# EAGLE design smart prototyping2 (EAGLE 7.3.0)
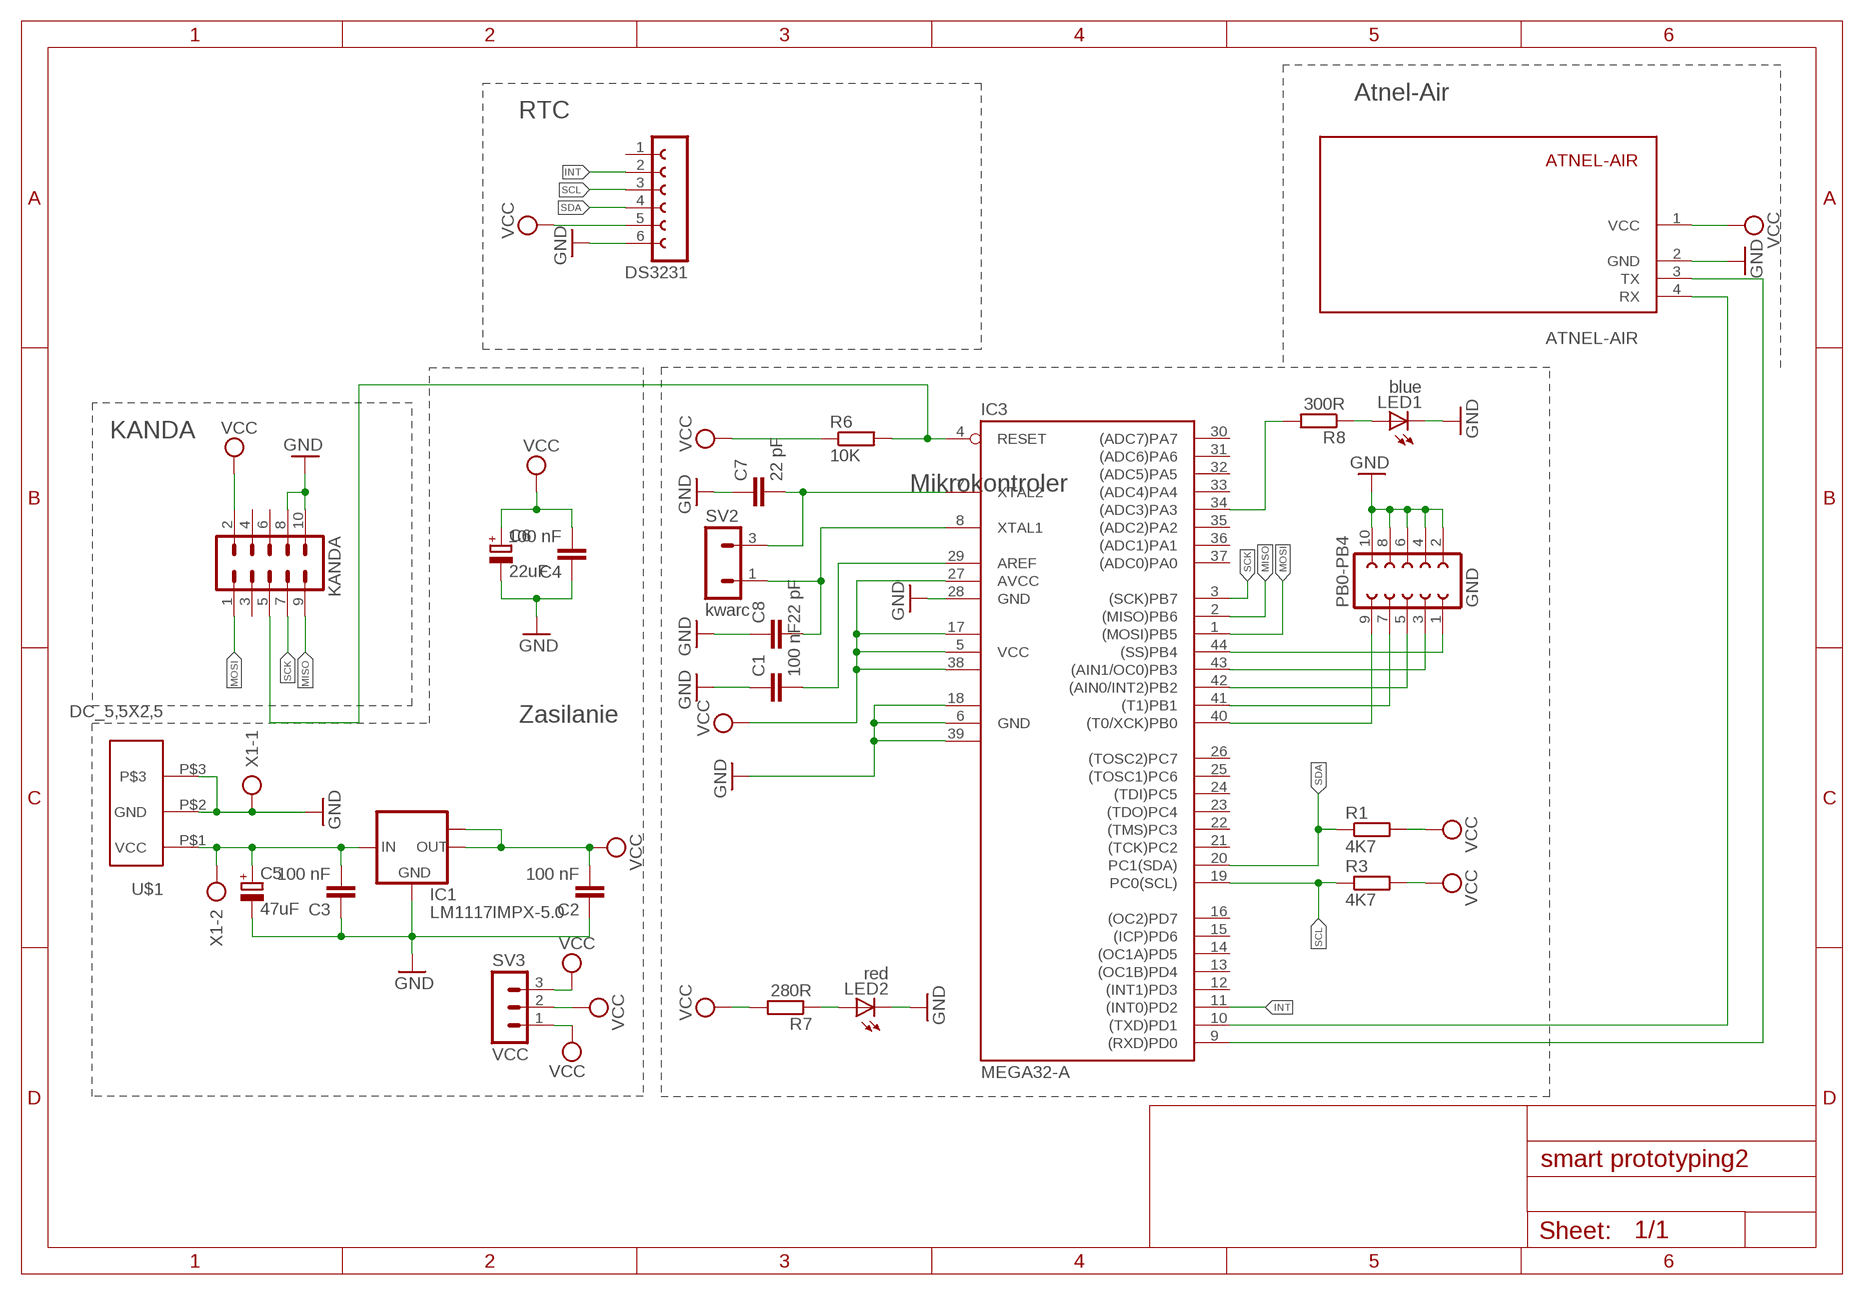
[diagram p0: schematic, sheet 1]

## Parts
ATNEL-AIR  ATNEL-AIR  [ATNEL-AIR]
C1  100 nF  C-EUC0805  [C0805]
C2  100 nF  C-EUC0805  [C0805]
C3  100 nF  C-EUC0805  [C0805]
C4  100 nF  C-EUC0805  [C0805]
C5  47uF  CPOL-EUB45181A  [B45181A]
C6  22uF  CPOL-EUB45181A  [B45181A]
C7  22 pF  C-EUC0805  [C0805]
C8  22 pF  C-EUC0805  [C0805]
DS3231  FE06-1  [FE06]
IC1  LM1117IMPX-5.0  [SOT223]
IC3  MEGA32-A  [TQFP44]
KANDA  ML10  [ML10]
LED1  blue  LEDCHIPLED_1206  [CHIPLED_1206]
LED2  red  LEDCHIPLED_1206  [CHIPLED_1206]
PB0-PB4  GND  FE05-2  [FE05-2]
R1  4K7  R-EU_R1206W  [R1206W]
R3  4K7  R-EU_R1206W  [R1206W]
R6  10K  R-EU_R1206W  [R1206W]
R7  280R  R-EU_R1206W  [R1206W]
R8  300R  R-EU_R1206W  [R1206W]
SV2  kwarc  MA03-1  [MA03-1]
SV3  VCC  MA03-1  [MA03-1]
U$1  DC_5,5X2,5  [DC_5,5X2,5]
X1  AK500/2  [AK500/2]

## Nets
GND: ATNEL-AIR.2(GND) C1.1 C2.1 C3.1 C4.1 C5.- C6.- C7.1 C8.1 DS3231.6 IC1.1(GND) IC3.6(GND) IC3.18(GND1) IC3.28(GND) IC3.39(GND2) KANDA.8 KANDA.10 LED1.C LED2.C PB0-PB4.2 PB0-PB4.4 PB0-PB4.6 PB0-PB4.8 PB0-PB4.10 U$1.P$2(GND) U$1.P$3 X1.1
INT: DS3231.2 IC3.11((INT0)PD2)
MISO: IC3.2((MISO)PB6) KANDA.9
MOSI: IC3.1((MOSI)PB5) KANDA.1
N$1: ATNEL-AIR.4(RX) IC3.10((TXD)PD1)
N$2: ATNEL-AIR.3(TX) IC3.9((RXD)PD0)
N$3: C1.2 IC3.29(AREF)
N$4: IC3.44((SS)PB4) PB0-PB4.1
N$5: IC3.43((AIN1/OC0)PB3) PB0-PB4.3
N$6: C3.2 C5.+ IC1.3(IN) U$1.P$1(VCC) X1.2
N$7: IC3.42((AIN0/INT2)PB2) PB0-PB4.5
N$8: IC3.41((T1)PB1) PB0-PB4.7
N$9: IC3.40((T0/XCK)PB0) PB0-PB4.9
N$10: C7.2 IC3.7(XTAL2) SV2.3
N$11: C8.2 IC3.8(XTAL1) SV2.1
N$12: LED2.A R7.1
N$16: LED1.A R8.1
N$17: IC3.34((ADC3)PA3) R8.2
RST: IC3.4(RESET) KANDA.5 R6.2
SCK: IC3.3((SCK)PB7) KANDA.7
SCL: DS3231.3 IC3.19(PC0(SCL)) R3.1
SDA: DS3231.4 IC3.20(PC1(SDA)) R1.1
VCC: ATNEL-AIR.1(VCC) C2.2 C4.2 C6.+ DS3231.5 IC1.2(OUT) IC1.TAB(OUT1) IC3.5(VCC) IC3.17(VCC1) IC3.27(AVCC) IC3.38(VCC2) KANDA.2 R1.2 R3.2 R6.1 R7.2 SV3.1 SV3.2 SV3.3
Unconnected: DS3231.1 IC3.12((INT1)PD3) IC3.13((OC1B)PD4) IC3.14((OC1A)PD5) IC3.15((ICP)PD6) IC3.16((OC2)PD7) IC3.21((TCK)PC2) IC3.22((TMS)PC3) IC3.23((TDO)PC4) IC3.24((TDI)PC5) IC3.25((TOSC1)PC6) IC3.26((TOSC2)PC7) IC3.30((ADC7)PA7) IC3.31((ADC6)PA6) IC3.32((ADC5)PA5) IC3.33((ADC4)PA4) IC3.35((ADC2)PA2) IC3.36((ADC1)PA1) IC3.37((ADC0)PA0) KANDA.3 KANDA.4 KANDA.6

## Notes on the sheet
- Atnel-Air
- RTC
- KANDA
- Mikrokontroler
- Zasilanie

## Library data of the parts
ATNEL-AIR = ATNEL-WIFI232-T:ATNEL-AIR
C1-C4 C7 C8 = rcl:C-EU: CAPACITOR, European symbol
C5 C6 = rcl:CPOL-EU: POLARIZED CAPACITOR, European symbol
DS3231 = con-lsta:FE06-1: FEMALE HEADER; OC_FARNELL: unknown; OC_NEWARK: unknown
IC1 = lm1117:LM1117IMPX-*
IC3 = atmel:MEGA32: MICROCONTROLLER 32 Kbytes FLASH 2 Kbytes SRAM 1 Kbytes EEPROM USART 8-channel 10 bit ADC Source: www.atmel.com .. doc2503.pdf; MPN: ATMEGA32-16AU; OC_FARNELL: 9171274; OC_NEWARK: 69K6677
KANDA = con-harting-ml:ML10: HARTING; OC_FARNELL: unknown; OC_NEWARK: unknown
LED1 LED2 = adafruit:LED: LED OSRAM: - CHIPLED LG R971, LG N971, LY N971, LG Q971, LY Q971, LO R971, LY R971 LH N974, LH R974 LS Q976, LO Q976, LY Q976 LO Q996 - Hyper CHIPLED LW Q18S LB Q993, LB Q99A, LB R99A - SideLED LS A670, LO A670, LY A670, LG A670, LP A670 LB A673, LV A673, LT A673, LW A673 LH A674 LY A675 LS A676, LA A676, LO A676, LY A676, LW A676 LS A679, LY A679, LG A679 - Hyper Micro SIDELED® LS Y876, LA Y876, LO Y876, LY Y876 LT Y87S - SmartLED LW L88C, LW L88S LB L89C, LB L89S, LG L890 LS L89K, LO L89K, LY L89K LS L896, LA L896, LO L896, LY L896 - TOPLED LS T670, LO T670, LY T670, LG T670, LP T670 LSG T670, LSP T670, LSY T670, LOP T670, LYG T670 LG T671, LOG T671, LSG T671 LB T673, LV T673, LT T673, LW T673 LH T674 LS T676, LA T676, LO T676, LY T676, LB T676, LH T676, LSB T676, LW T676 LB T67C, LV T67C, LT T67C, LS T67K, LO T67K, LY T67K, LW E67C LS E67B, LA E67B, LO E67B, LY E67B, LB E67C, LV E67C, LT E67C LW T67C LS T679, LY T679, LG T679 LS T770, LO T770, LY T770, LG T770, LP T770 LB T773, LV T773, LT T773, LW T773 LH T774 LS E675, LA E675, LY E675, LS T675 LS T776, LA T776, LO T776, LY T776, LB T776 LHGB T686 LT T68C, LB T68C - Hyper Mini TOPLED® LB M676 - Mini TOPLED Santana® LG M470 LS M47K, LO M47K, LY M47K Source: http://www.osram.convergy.de/
PB0-PB4 = con-lsta:FE05-2: FEMALE HEADER; OC_FARNELL: unknown; OC_NEWARK: unknown
R1 R3 R6-R8 = resistor:R-EU_: RESISTOR, European symbol
SV2 = con-lstb-wachcio:MA03-1: PIN HEADER; OC_FARNELL: unknown; OC_NEWARK: unknown
SV3 = con-lstb:MA03-1: PIN HEADER; OC_FARNELL: unknown; OC_NEWARK: unknown
U$1 = wachcio:DC_5,5X2,5
X1 = con-ptr500:AK500/2: CONNECTOR; OC_FARNELL: unknown; OC_NEWARK: unknown

## Board
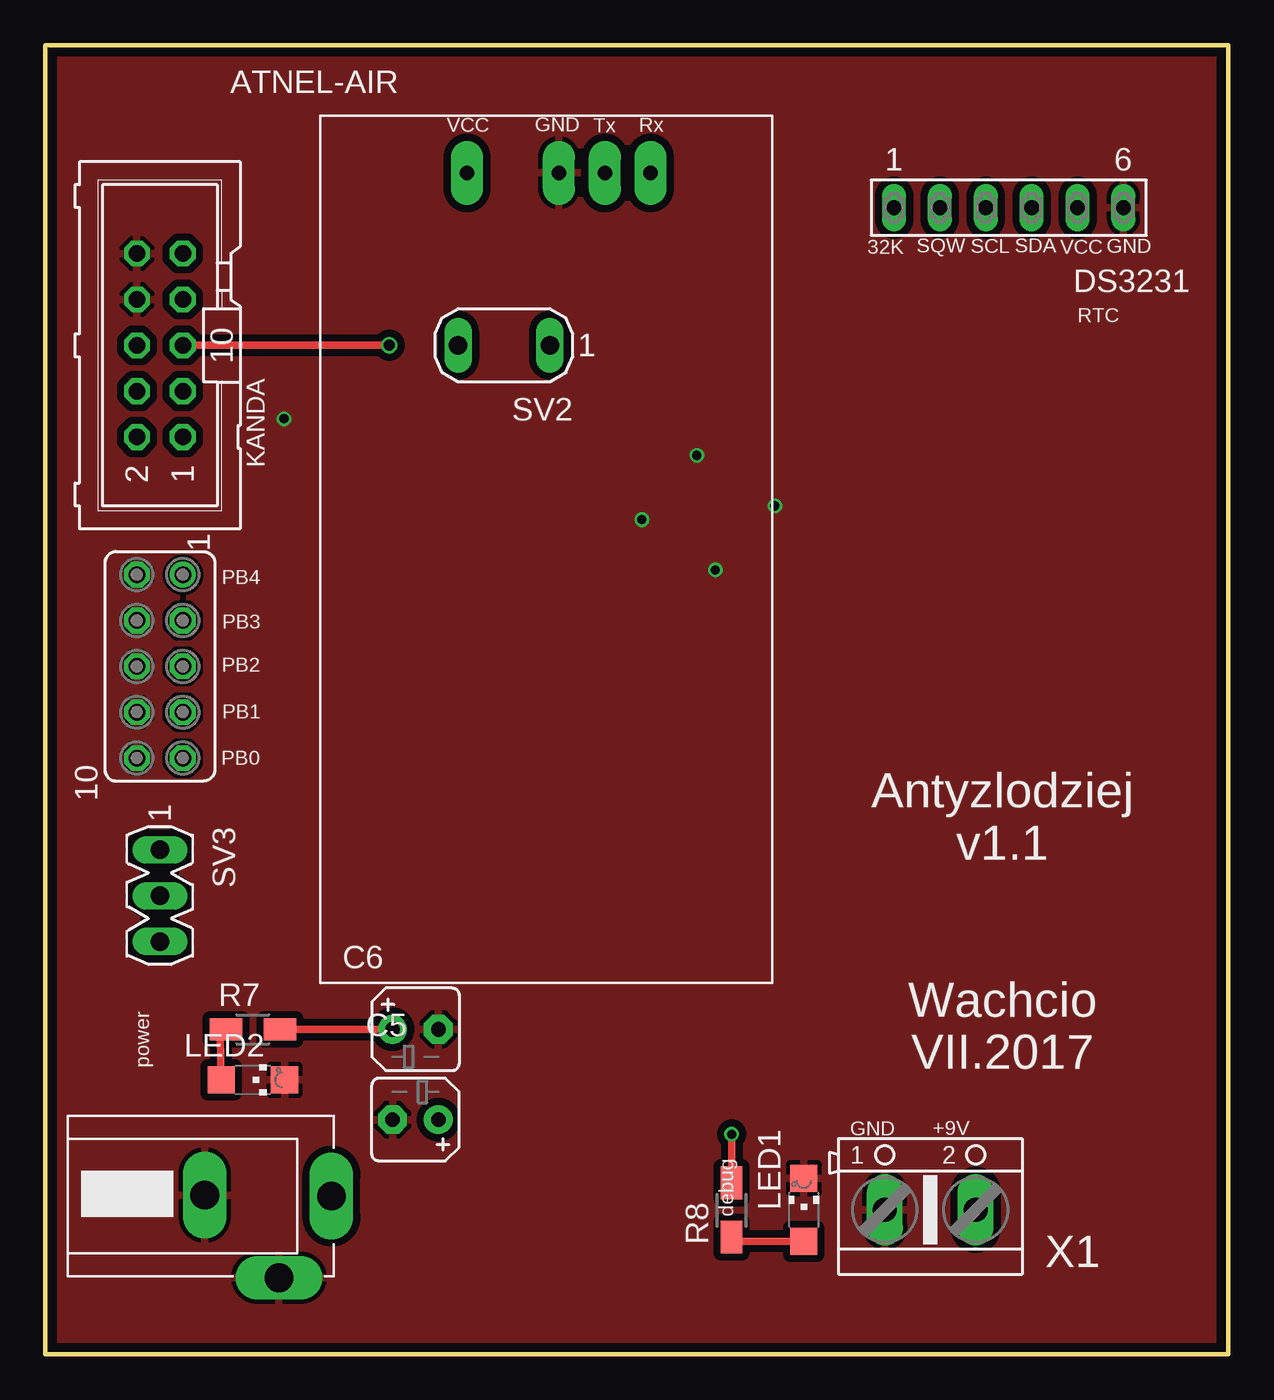
[diagram p1: board, top side]
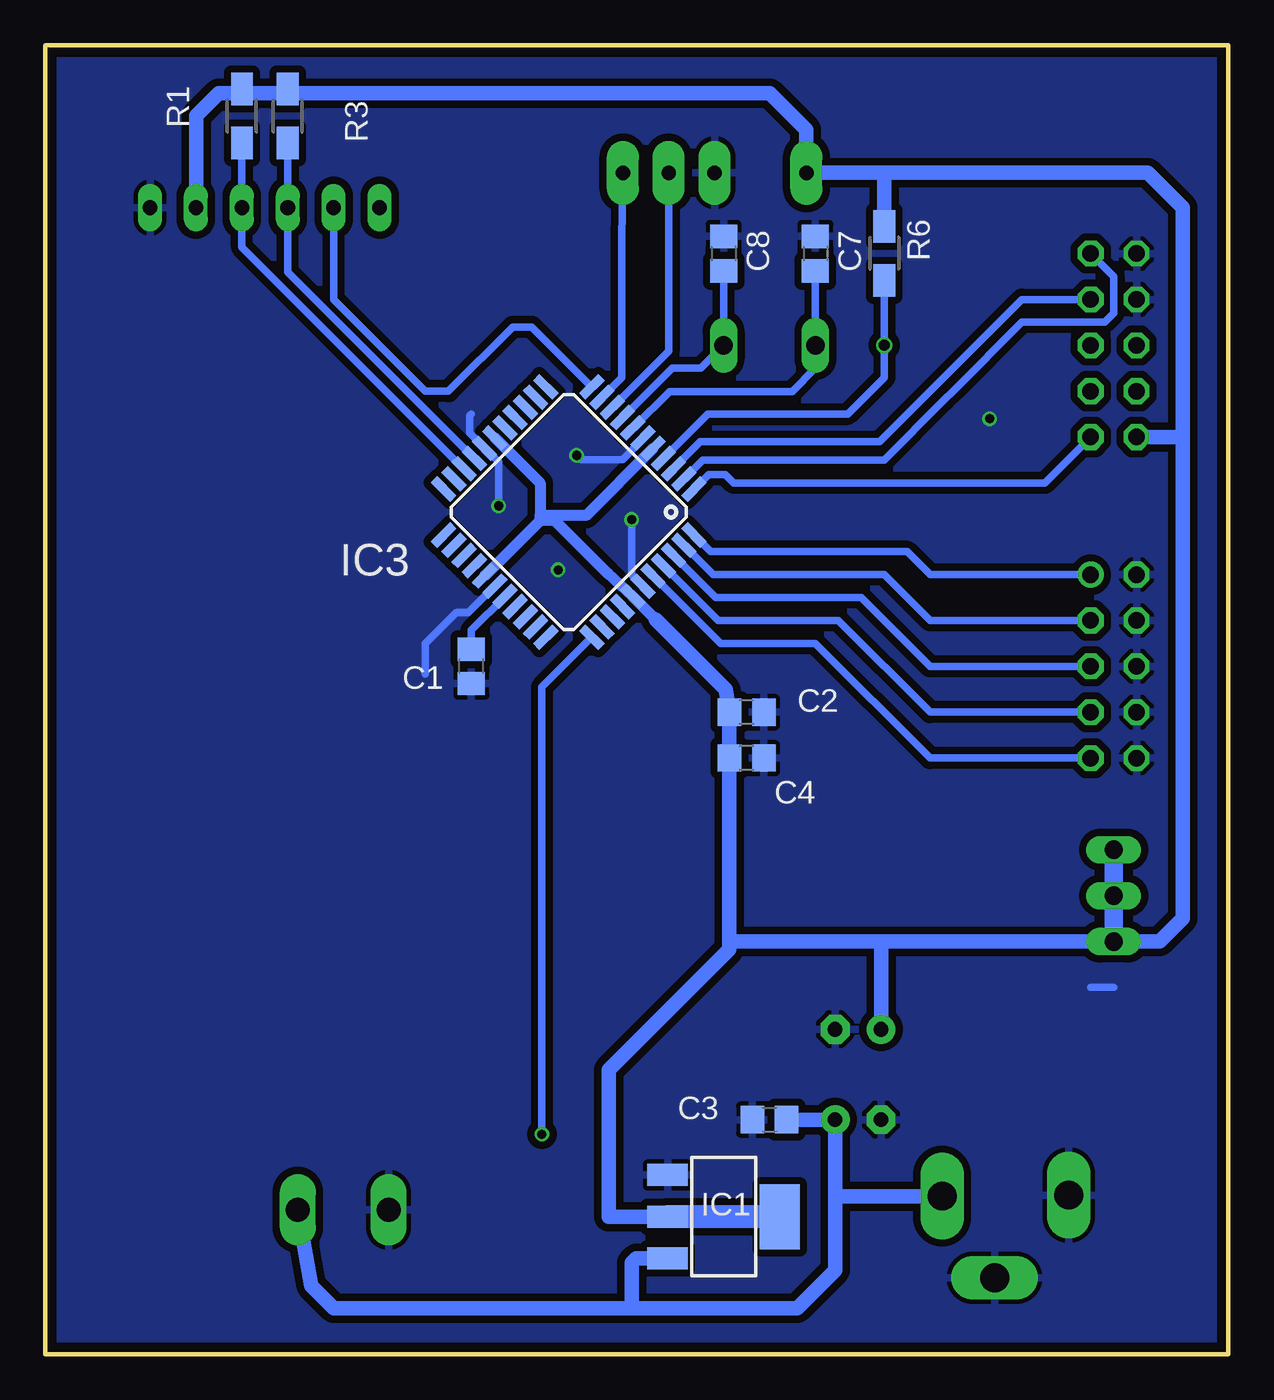
[diagram p2: board, bottom side, seen from below]

Size 65.5 x 72.5 mm. Coordinates in mm from the lower left corner, seen from the top.
Outline: 62.23,0 65.5,0
Outline: 65.5,0 0,0 0,72.5 65.5,72.5 65.5,0
Copper layers (1*16): Top 0.035mm / dielectric 1.5mm / Bottom 0.035mm
Design rules "smart-prototyping": minimum track width 7mil, minimum drill 12mil, track to track 7mil, track to pad 7mil, pad to pad 7mil, via to via 7mil, smd to smd 0mil, copper to edge 20mil, drill to drill 10mil, minimum pad ring 10mil, minimum via ring 6mil, stop-mask expansion 2mil, vias tented up to drill 25mil, thermal gap 10mil

### Footprints (pad centres in the part's own frame; a part is rotated, then mirrored left to right if it is on the bottom)
ATNEL-AIR = drill 0.8 pad 1.778 long: 1 3.15,8.12; 2 3.15,13.2; 3 3.15,15.74; 4 3.15,18.28
C0805 = smd 1.3 x 1.5: 1 -0.95,0; 2 0.95,0
B45181A = drill 0.813 pad 1.6: + -1.27,0 | drill 0.813 pad 1.6 octagon: - 1.27,0
FE06 = drill 0.813 long: 1 -6.35,0; 2 -3.81,0; 3 -1.27,0; 4 1.27,0; 5 3.81,0; 6 6.35,0
SOT223 = smd 1.219 x 2.235: 1 -2.311,-3.099; 2 0,-3.099; 3 2.311,-3.099 | smd 3.6 x 2.2: TAB 0,3.099
TQFP44 = smd 1.5 x 0.5: 1 -5.8,4; 2 -5.8,3.2; 3 -5.8,2.4; 4 -5.8,1.6; 5 -5.8,0.8; 6 -5.8,0; 7 -5.8,-0.8; 8 -5.8,-1.6; 9 -5.8,-2.4; 10 -5.8,-3.2; 11 -5.8,-4; 23 5.8,-4; 24 5.8,-3.2; 25 5.8,-2.4; 26 5.8,-1.6; 27 5.8,-0.8; 28 5.8,0; 29 5.8,0.8; 30 5.8,1.6; 31 5.8,2.4; 32 5.8,3.2; 33 5.8,4 | smd 0.5 x 1.5: 12 -4,-5.8; 13 -3.2,-5.8; 14 -2.4,-5.8; 15 -1.6,-5.8; 16 -0.8,-5.8; 17 0,-5.8; 18 0.8,-5.8; 19 1.6,-5.8; 20 2.4,-5.8; 21 3.2,-5.8; 22 4,-5.8; 34 4,5.8; 35 3.2,5.8; 36 2.4,5.8; 37 1.6,5.8; 38 0.8,5.8; 39 0,5.8; 40 -0.8,5.8; 41 -1.6,5.8; 42 -2.4,5.8; 43 -3.2,5.8; 44 -4,5.8
ML10 = drill 0.914 octagon: 1 -5.08,-1.27; 2 -5.08,1.27; 3 -2.54,-1.27; 4 -2.54,1.27; 5 0,-1.27; 6 0,1.27; 7 2.54,-1.27; 8 2.54,1.27; 9 5.08,-1.27; 10 5.08,1.27
CHIPLED_1206 = smd 1.5 x 1.5: A 0,-1.75; C 0,1.75
FE05-2 = drill 0.914: 1 -5.08,1.27 | drill 0.914 octagon: 2 -5.08,-1.27; 3 -2.54,1.27; 4 -2.54,-1.27; 5 0,1.27; 6 0,-1.27; 7 2.54,1.27; 8 2.54,-1.27; 9 5.08,1.27; 10 5.08,-1.27
R1206W = smd 1.8 x 1.2: 1 -1.499,0; 2 1.499,0
MA03-1 = drill 1.016 long: 1 -2.54,0; 3 2.54,0
MA03-1' = drill 1.016 long: 1 -2.54,0; 2 0,0; 3 2.54,0
DC_5,5X2,5 = drill 1.6 long: P$1 14.605,4.445; P$2 11.7,-0.07; P$3 7.6,4.5
AK500/2 = drill 1.321 long: 1 -2.515,0; 2 2.515,0

### Placement (x,y rotation side)
ATNEL-AIR  15.24,68.58 270 top
C1  41.91,38.1 90 bottom
C2  26.67,35.56 180 bottom
C3  25.4,13 0 bottom
C4  26.67,33.02 180 bottom
C5  20.5,13 180 top
C6  20.5,18 0 top
C7  22.86,60.96 270 bottom
C8  27.94,60.96 270 bottom
DS3231  53.34,63.5 0 top
IC1  27.94,7.62 270 bottom
IC3  36.51,46.64 225 bottom
KANDA  6.35,55.88 90 top
LED1  42,8 0 top
LED2  11.5,15.2 270 top
PB0-PB4  6.35,38.1 270 top
R1  54.61,68.58 90 bottom
R3  52.07,68.58 90 bottom
R6  19.05,60.96 270 bottom
R7  11.5,18 0 top
R8  38,8 90 top
SV2  25.4,55.88 180 top
SV3  VCC  [MA03-1']  6.35,25.4 270 top
U$1  1.24,4.32 0 top
X1  49,8 0 top

### Tracks (layer width: path | path; a pad name or v marks a point on that pad's centre or on a via)
GND  (via drill 0.5)
  Bottom 0.406: 41.91,52.07 41.99,51.99 41.99,51 41.18,50.19 IC3.18 40.4,49.4 v40.4,46.99 | 41.18,50.17 41.15,50.17 | IC3.28 42.09,41.07 42.75,41.07 44.45,39.37 44.45,37.67 | 6.35,20.32 7.62,20.32 | IC3.6 32.41,50.68 33.53,49.55 35.85,49.55 v36.08,49.78 | v33.03,46.23 33.03,43.17 IC3.39
  Bottom 0.5: IC3.18 41.18,50.17 | IC3.6
  other vias: 37.1,43.43 13.22,51.82
  pour Bottom (isolate 0.406, rank 4): 0,0 0,72.5 65.5,72.5 65.5,0
  pour Top (isolate 0.406): 0,0 0,72.5 65.5,72.5 65.5,0
INT
  Bottom 0.406: IC3.11 38.56,56.9 39.62,56.9 43.18,53.34 44.45,53.34 49.53,58.42 DS3231.2
MISO
  Bottom 0.406: IC3.2 29.1,49.53 19.05,49.53 15.75,52.83 15.24,53.34 11.43,57.15 6.86,57.15 6.35,57.66 6.35,59.69 KANDA.9
MOSI
  Bottom 0.406: 29.55,47.92 IC3.1 28.78,48.72 27.84,48.72 27.38,48.26 10.16,48.26 KANDA.1
N$1
  Bottom 0.406: IC3.10 34.65,53.01 33.58,54.08 33.58,61.56 ATNEL-AIR.4
N$2
  Bottom 0.406: ATNEL-AIR.3 30.98,55.57 IC3.9
N$3
  Bottom 0.406: IC3.29 41.91,40.11 C1.2
N$4
  Bottom 0.406: PB0-PB4.1 16.51,43.18 17.78,44.45 28.66,44.45 IC3.44
N$5
  Bottom 0.406: PB0-PB4.3 16.51,40.64 19.05,43.18 28.52,43.18 IC3.43
N$6
  Bottom 0.813: C3.2 C5.+ 21.77,8.76 | X1.2 50.77,3.79 49.53,2.54 33.02,2.54 | 33.02,2.54 23.88,2.54 21.77,4.65 21.77,8.76 | IC1.3 32.79,5.31 33.02,5.08 33.02,2.54 | U$1.P$1 21.77,8.76
N$7
  Bottom 0.406: PB0-PB4.5 16.51,38.1 20.32,41.91 28.38,41.91 IC3.42
N$8
  Bottom 0.406: PB0-PB4.7 16.51,35.56 21.59,40.64 28.24,40.64 IC3.41
N$9
  Bottom 0.406: PB0-PB4.9 16.51,33.02 22.86,39.37 28.1,39.37 IC3.40
N$10
  Bottom 0.406: IC3.7 32.94,51.31 30.94,53.31 24.16,53.31 22.86,54.61 SV2.3 C7.2
N$11
  Bottom 0.406: IC3.8 33.52,51.88 30.79,54.61 29.21,54.61 SV2.1 C8.2
N$12
  Top 0.406: R7.1 9.68,17.55 LED2.A
N$16
  Top 0.406: LED1.A 38,6.25 R8.1
N$17  (via drill 0.5)
  Top 0.406: v38,12.19 R8.2
  Bottom 0.406: v38,12.19 38,36.95 IC3.34
RST  (via drill 0.6)
  Top 0.406: KANDA.5 v19.05,55.88
  Bottom 0.406: IC3.4 28.82,52.07 21.08,52.07 19.05,54.1 v19.05,55.88 R6.2
SCK
  Bottom 0.406: IC3.3 30.71,49.07 29.23,50.55 19.3,50.55 11.43,58.42 KANDA.7
SCL
  Bottom 0.406: R3.1 DS3231.3 52.07,59.94 IC3.19
SDA
  Bottom 0.406: R1.1 DS3231.4 54.61,61.32 42.34,49.05 IC3.20
VCC
  Top 0.406: R7.2 C6.+
  Bottom 0.406: 40.59,50.74 IC3.17 40.61,50.77 | IC3.27 41.18,43.13
  Bottom 0.61: 31.69,40.7 IC3.38 34.36,43.25 37.29,46.18 38.1,46.18 | IC3.5 35.56,46.46 38.1,46.46 | 40.59,50.74 38.1,48.26 38.1,46.46 | 38.1,46.18 IC3.27 | 38.1,46.18 38.1,46.46
  Bottom 0.813: 2.54,50.8 2.54,24.13 3.81,22.86 SV3.3 19.23,22.86 | 2.54,50.8 2.54,63.5 4.47,65.43 19.05,65.43 | 54.38,69.85 R1.2 | 54.38,69.85 55.88,69.85 57.15,68.58 DS3231.5 | KANDA.2 2.54,50.8 | 54.38,69.85 52.3,69.85 R3.2 51.84,69.85 25.4,69.85 23.36,67.81 ATNEL-AIR.1 19.05,65.43 | R6.1 19.05,65.43 | IC1.2 34.29,7.62 34.29,15.75 27.62,22.42 27.62,22.86 | 31.69,40.7 27.83,36.83 C2.2 C4.2 27.62,24.13 27.62,22.86 | 19.23,22.86 C6.+ | 19.23,22.86 27.62,22.86
  Bottom 1.016: SV3.3 SV3.2 SV3.1
  Bottom 1.27: IC1.TAB IC1.2

### Text on the board
tPlace: VCC | GND | Tx | Rx | RTC | power | GND | +9V | debug
tNames: 32K | SQW | SCL | SDA | VCC | GND | PB4 | PB3 | PB2 | PB1 | PB0 | Antyzlodziej / v1.1 / / / Wachcio / VII.2017